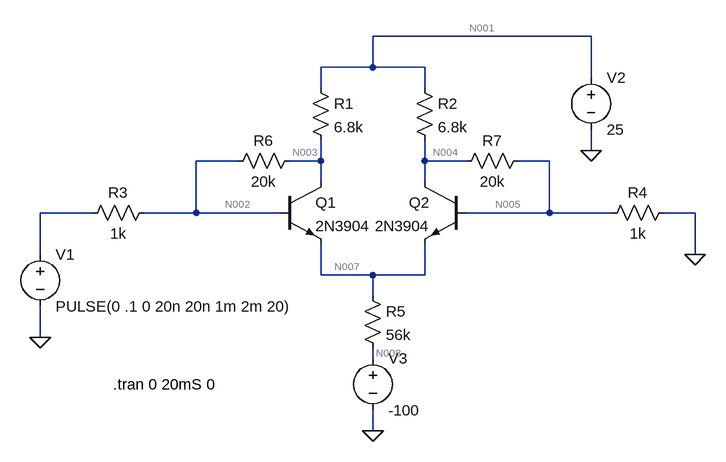
[diagram p0: schematic diffAmp.asc]
diffAmp.asc, the LTspice schematic file:
Version 4
SHEET 1 1000 680
WIRE 656 -224 320 -224
WIRE 320 -176 320 -224
WIRE 320 -176 240 -176
WIRE 400 -176 320 -176
WIRE 656 -160 656 -224
WIRE 240 -144 240 -176
WIRE 400 -144 400 -176
WIRE 656 -48 656 -80
WIRE 112 -32 48 -32
WIRE 240 -32 240 -64
WIRE 240 -32 192 -32
WIRE 400 -32 400 -64
WIRE 464 -32 400 -32
WIRE 592 -32 544 -32
WIRE 240 0 240 -32
WIRE 400 0 400 -32
WIRE -112 48 -192 48
WIRE 48 48 48 -32
WIRE 48 48 -32 48
WIRE 176 48 48 48
WIRE 592 48 592 -32
WIRE 592 48 464 48
WIRE 688 48 592 48
WIRE 816 48 768 48
WIRE -192 112 -192 48
WIRE 816 112 816 48
WIRE 240 144 240 96
WIRE 320 144 240 144
WIRE 400 144 400 96
WIRE 400 144 320 144
WIRE 320 176 320 144
WIRE -192 240 -192 192
WIRE 320 272 320 256
WIRE 320 384 320 352
FLAG 816 112 0
FLAG 320 384 0
FLAG 656 -48 0
FLAG -192 240 0
SYMBOL npn 176 0 R0
SYMATTR InstName Q1
SYMATTR Value 2N3904
SYMBOL npn 464 0 M0
SYMATTR InstName Q2
SYMATTR Value 2N3904
SYMBOL res 224 -160 R0
SYMATTR InstName R1
SYMATTR Value 6.8k
SYMBOL res 384 -160 R0
SYMATTR InstName R2
SYMATTR Value 6.8k
SYMBOL voltage -192 96 R0
WINDOW 123 0 0 Left 0
WINDOW 39 0 0 Left 0
SYMATTR InstName V1
SYMATTR Value PULSE(0 .1 0 20n 20n 1m 2m 20)
SYMBOL voltage 656 -176 R0
WINDOW 123 0 0 Left 0
WINDOW 39 0 0 Left 0
SYMATTR InstName V2
SYMATTR Value 25
SYMBOL voltage 320 256 R0
WINDOW 123 0 0 Left 0
WINDOW 39 0 0 Left 0
SYMATTR InstName V3
SYMATTR Value -100
SYMBOL res -16 32 R90
WINDOW 0 0 56 VBottom 2
WINDOW 3 32 56 VTop 2
SYMATTR InstName R3
SYMATTR Value 1k
SYMBOL res 784 32 R90
WINDOW 0 0 56 VBottom 2
WINDOW 3 32 56 VTop 2
SYMATTR InstName R4
SYMATTR Value 1k
SYMBOL res 304 160 R0
SYMATTR InstName R5
SYMATTR Value 56k
SYMBOL res 208 -48 R90
WINDOW 0 0 56 VBottom 2
WINDOW 3 32 56 VTop 2
SYMATTR InstName R6
SYMATTR Value 20k
SYMBOL res 560 -48 R90
WINDOW 0 0 56 VBottom 2
WINDOW 3 32 56 VTop 2
SYMATTR InstName R7
SYMATTR Value 20k
TEXT -80 312 Left 2 !.tran 0 20mS 0

The netlist it stands for:
* diffAmp.asc
Q1 N003 N002 N007 0 2N3904
Q2 N004 N005 N007 0 2N3904
R1 N001 N003 6.8k
R2 N001 N004 6.8k
V1 N006 0 PULSE(0 .1 0 20n 20n 1m 2m 20)
V2 N001 0 25
V3 N008 0 -100
R3 N002 N006 1k
R4 0 N005 1k
R5 N007 N008 56k
R6 N003 N002 20k
R7 N005 N004 20k
.model NPN NPN
.model PNP PNP
.lib standard.bjt
.tran 0 20mS 0
.backanno
.end

* Results of the author's LTspice run, read from the files saved beside the schematic
* Operating Point, zero values left out:
*   V(n003) = 14.31 V
*   V(n002) = 678.9 mV
*   V(n007) = 29.93 mV
*   V(n004) = 14.31 V
*   V(n005) = 678.9 mV
*   V(n001) = 25 V
*   V(n008) = -100 V
*   Ic(Q2) = 890.5 µA
*   Ib(Q2) = 2.617 µA
*   Ie(Q2) = -893.1 µA
*   Ic(Q1) = 890.5 µA
*   Ib(Q1) = 2.617 µA
*   Ie(Q1) = -893.1 µA
*   I(R7) = -681.6 µA
*   I(R6) = 681.6 µA
*   I(R5) = 1.786 mA
*   I(R4) = -678.9 µA
*   I(R3) = 678.9 µA
*   I(R2) = 1.572 mA
*   I(R1) = 1.572 mA
*   I(V3) = 1.786 mA
*   I(V2) = -3.144 mA
*   I(V1) = 678.9 µA